# Altium schematic sheet Schematic.SchDoc
size A
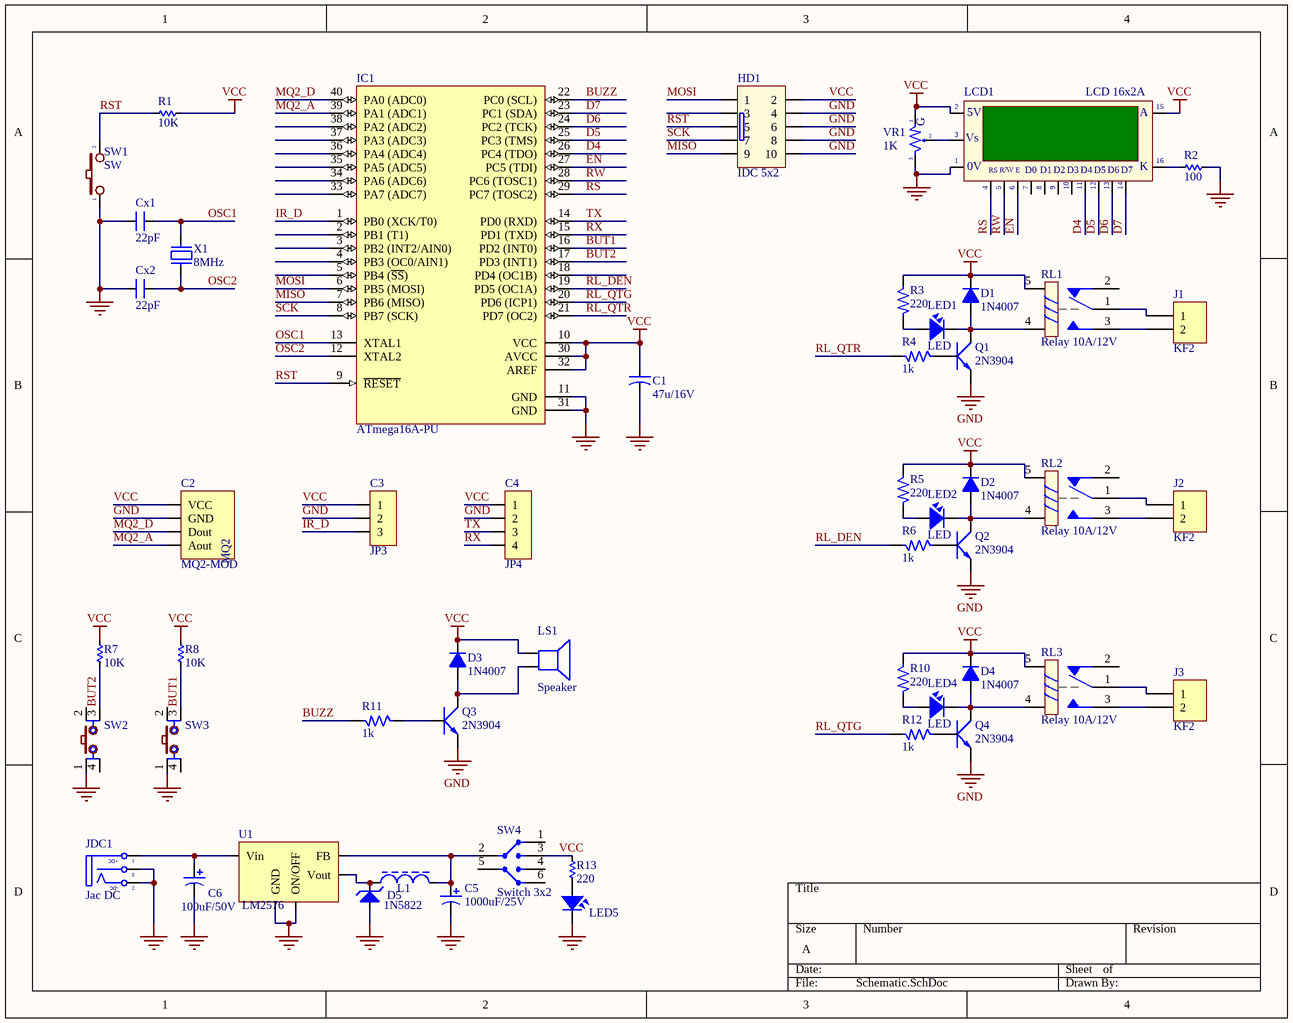
[diagram p0: Schematic.SchDoc]

## Parts
C1  47u/16V  [CA-ALU-2.54]
C2  MQ2-MOD  [MQ2-MODULE]
C3  JP3  [JP3-D1T]
C4  JP4  [JP4-C1T]
C5  value 1000uF/25V  [CE_12.5x20]  (hidden comment: CP4)
C6  value 100uF/50V  [CE_8x12]  (hidden comment: CP3)
Cx1  22pF  [CN1]
Cx2  22pF  [CN1]
D1  1N4007  [DIO-1A-SMALL]
D2  1N4007  [DIO-1A-SMALL]
D3  1N4007  [DIO-1A-SMALL]
D4  1N4007  [DIO-1A-SMALL]
D5  1N5822  [D5A]
HD1  IDC 5x2  [IDC10]
IC1  ATmega16A-PU  [DIP40/W0.6]
J1  KF2  [KF2-5.08]
J2  KF2  [KF2-5.08]
J3  KF2  [KF2-5.08]
JDC1  Jac DC  [DC0]
L1  INDUCTOR  [L]  (value not drawn)
LCD1  LCD 16x2A  [LCD16X2N]
LED1  LED  [LED-3MM-RED]
LED2  LED  [LED-3MM-RED]
LED4  LED  [LED-3MM-RED]
LED5  LED  [LED-3MM-RED]  (value not drawn)
LS1  Speaker  [SPEAKER]
Q1  2N3904  [TO92-123]
Q2  2N3904  [TO92-123]
Q3  2N3904  [TO92-123]
Q4  2N3904  [TO92-123]
R1  10K  [RES-1/4W-SMALL]
R2  100  [RES-1/4W-SMALL]
R3  220  [RES-1/4W-SMALL]
R4  1k  [RES-1/4W-SMALL]
R5  220  [RES-1/4W-SMALL]
R6  1k  [RES-1/4W-SMALL]
R7  10K  [RES-1/4W-SMALL]
R8  10K  [RES-1/4W-SMALL]
R10  220  [RES-1/4W-SMALL]
R11  1k  [RES-1/4W-SMALL]
R12  1k  [RES-1/4W-SMALL]
R13  220  [RES-1/4W-SMALL]
RL1  Relay 10A/12V  [RELAY 5]
RL2  Relay 10A/12V  [RELAY 5]
RL3  Relay 10A/12V  [RELAY 5]
SW1  SW  [SW2_6x6x6.5]
SW2  SW  [SW4-12x12x8]  (value not drawn)
SW3  SW  [SW4-12x12x8]  (value not drawn)
SW4  Switch 3x2  [SW3-DIP]
U1  LM2576  [TO-220_5]
VR1  1K  [VR-S2]
X1  8MHz  [XT2]

## Nets
GND: C1.2 C2.3(GND) C3.2 C4.2 C5.2 C6.2 Cx1.1 Cx2.1 D5.1 HD1.4 HD1.6 HD1.8 HD1.10 IC1.11(GND) IC1.31(GND) JDC1.2(TN) JDC1.3(S) LCD1.1(GND) LED5.2 Q1.1(E) Q2.1(E) Q3.1(E) Q4.1(E) R2.1 SW1.1 SW2.1 SW3.1 U1.3(GND) U1.5(ON/OFF) VR1.3
VCC: C1.1 C2.4(VCC) C3.1 C4.1 D1.2(K) D2.2(K) D3.2(K) D4.2(K) HD1.2 IC1.10(VCC) IC1.30(AVCC) IC1.32(AREF) LCD1.2(VDD) LCD1.15(A) LS1.1 R1.1 R3.1 R5.1 R7.2 R8.2 R10.1 R13.1 RL1.5 RL2.5 RL3.5 SW4.3(I/O2) VR1.1
BUT1: IC1.16(PD2_(INT0)) R8.1 SW3.3
BUT2: IC1.17(PD3_(INT1)) R7.1 SW2.3
BUZZ: IC1.22(PC0_(SCL)) R11.2
D4: IC1.26(PC4_(TDO)) LCD1.11(D4)
D5: IC1.25(PC3_(TMS)) LCD1.12(D5)
D6: IC1.24(PC2_(TCK)) LCD1.13(D6)
D7: IC1.23(PC1_(SDA)) LCD1.14(D7)
EN: IC1.27(PC5_(TDI)) LCD1.6(~{EN})
IR_D: C3.3 IC1.1(PB0_(XCK/T0))
MISO: HD1.9 IC1.7(PB6_(MISO))
MOSI: HD1.1 IC1.6(PB5_(MOSI))
MQ2_A: C2.1(Aout) IC1.39(PA1_(ADC1))
MQ2_D: C2.2(Dout) IC1.40(PA0_(ADC0))
OSC1: Cx1.2 IC1.13(XTAL1) X1.2
OSC2: Cx2.2 IC1.12(XTAL2) X1.1
RL_DEN: IC1.19(PD5_(OC1A)) R6.2
RL_QTG: IC1.20(PD6_(ICP1)) R12.2
RL_QTR: IC1.21(PD7_(OC2)) R4.2
RS: IC1.29(PC7_(TOSC2)) LCD1.4(RS)
RST: HD1.5 IC1.9(~{RESET}) R1.2 SW1.2
RW: IC1.28(PC6_(TOSC1)) LCD1.5(R/~{W})
RX: C4.4 IC1.15(PD1_(TXD))
SCK: HD1.7 IC1.8(PB7_(SCK))
TX: C4.3 IC1.14(PD0_(RXD))
NetC5_1: C5.1 L1.2 SW4.2 U1.4(FB)
NetC6_1: C6.1 JDC1.1(T) U1.1(Vin)
NetD1_1: D1.1(A) LED1.2 Q1.3(C) RL1.4
NetD2_1: D2.1(A) LED2.2 Q2.3(C) RL2.4
NetD3_1: D3.1(A) LS1.2 Q3.3(C)
NetD4_1: D4.1(A) LED4.2 Q4.3(C) RL3.4
NetD5_2: D5.2 L1.1 U1.2(Vout)
NetJ1_1: J1.1 RL1.1
NetJ1_2: J1.2 RL1.3
NetJ2_1: J2.1 RL2.1
NetJ2_2: J2.2 RL2.3
NetJ3_1: J3.1 RL3.1
NetJ3_2: J3.2 RL3.3
NetLCD1_3: LCD1.3(VEE) VR1.2
NetLCD1_16: LCD1.16(K) R2.2
NetLED1_1: LED1.1 R3.2
NetLED2_1: LED2.1 R5.2
NetLED4_1: LED4.1 R10.2
NetLED5_1: LED5.1 R13.2
NetQ1_2: Q1.2(B) R4.1
NetQ2_2: Q2.2(B) R6.1
NetQ3_2: Q3.2(B) R11.1
NetQ4_2: Q4.2(B) R12.1

Not connected (* = marked no-connect by the designer): HD1 3; IC1 2(PB1_(T1)) 3(PB2_(INT2/AIN0)) 4(PB3_(OC0/AIN1)) 5(PB4_(~{SS})) 18(PD4_(OC1B)) 33(PA7_(ADC7)) 34(PA6_(ADC6)) 35(PA5_(ADC5)) 36(PA4_(ADC4)) 37(PA3_(ADC3)) 38(PA2_(ADC2)); LCD1 7(D0) 8(D1) 9(D2) 10(D3); RL1 2; RL2 2; RL3 2; SW2 2 4; SW3 2 4; SW4 1 4 5(6) 6

## Notes on the sheet
- (in symbol DCIN) +DC; -DC
- (in symbol LCD16x2A) 5V; Vs; |; 0V; R/W; E
- (in symbol MQ2-MOD) MQ2
- (in symbol VR-S) G

## Library data of the parts
C1 = CN-ALU-DIP: Capacitor (Semiconductor SIM Model); Value: 104; LatestRevisionDate: 17-Jul-2002; LatestRevisionNote: Re-released for DXP Platform.; PackageReference: C1206; Publisher: Altium Limited
C2 = MQ2-MOD: Manufacturer: W¨¹rth Elektronik eiSos GmbH; partNo: 613004143121; ComponentLink1 Description: Manufacturer; ComponentLink2 Description: Datasheet; NoPins: 04; Created Date: 29 March 2013; ComponentLink1URL: http://www.we-online.com; ComponentLink2URL: http://katalog.we-online.de/em/datasheet/6130xx143121.pdf; Created by: Karrer Zheng
C3 = JP3: WR-PHD 2.54 mm Angled Socket Header; Manufacturer: W¨¹rth Elektronik eiSos GmbH; partNo: 613003143121; ComponentLink1 Description: Manufacturer; ComponentLink2 Description: Datasheet; NoPins: 03; Created Date: 29 March 2013; ComponentLink1URL: http://www.we-online.com; ComponentLink2URL: http://katalog.we-online.de/em/datasheet/6130xx143121.pdf; Created by: Karrer Zheng
C4 = JP4: WR-PHD 2.54 mm Angled Socket Header; Manufacturer: W¨¹rth Elektronik eiSos GmbH; partNo: 613004143121; ComponentLink1 Description: Manufacturer; ComponentLink2 Description: Datasheet; NoPins: 04; Created Date: 29 March 2013; ComponentLink1URL: http://www.we-online.com; ComponentLink2URL: http://katalog.we-online.de/em/datasheet/6130xx143121.pdf; Created by: Karrer Zheng
C5 = CP4: Cap P  1000uF/16V - 220uF/50V; Description 1: 2200uF-3300uF/6,3V - 1000uF-2200uF/10V; Description 2: 1000uF/16V - 470uF => 1000uF/25V - 100uF/100V; Description 3: 330uF>470uF/35V_220uF>470uF/50V_10uF>22uF/250V; Description 4: 220uF => 330uF/63V - 10uF =>33uF/160 - 200V; Description 5: 4,7uF>10uF/250V_3,3uF>10uF/400V - 2,2uF>4,7uF/450V
C6 = CP3: Cap P  470uF/16V - 100uF?35V; Description 1: 1000uF/6,3V - 470uF/16V - 330uF - 25V; Description 2: 220uF/35V - 100uF/50V - 63V - 4,7uF/200V; Description 3: 22uF => 33uF100V - 3,3uF => 4,7uF/250V; Description 4: 2,2uF =>3,3uF/350 - 2,2uF/400V - 1uF/450V
Cx1 Cx2 = CN: Value: 33pF
D1-D4 = D1A: Diode 1A; Value: 1N4007
HD1 = IDC 5X2: Value: Header 5x2
IC1 = ATmega16A-PU: 8-Bit AVR Microcontroller with 16K Bytes of In-System Programmable Flash Memory; Value: Atmega 16L
J1-J3 = KF2: Manufacturer: Würth Elektronik eiSos GmbH; partNo: 691103110002; ComponentLink1 Description: Manufacturer; ComponentLink2 Description: Datasheet; NoPins: 2; Created Date: 29 October 2013; ComponentLink1URL: http://www.we-online.com; ComponentLink2URL: http://katalog.we-online.de/em/datasheet/6911031100xx.pdf; Created by: Karrer Zheng
JDC1 = DCIN: Jac DC input; Value: Jac DC
LCD1 = LCD16x2A: LCD dipslay 16 char, 2 line; Value: LCD16x2A
LED1 LED2 LED4 = LED: LED Single colour Green and Red; Value: LED 3 ly Single Colour
LED5 = LED SMD: Value: LED 3 - 5 ly 2 Colour
LS1 = Speaker: Loudspeaker; Published: 24-Mar-1999; LatestRevisionDate: 17-Jul-2002; LatestRevisionNote: Re-released for DXP Platform.; PackageReference: PIN2; Publisher: Altium Limited
Q1-Q4 = 2N904: NPN 600mW, ECB; Value: C1815
R1 R2 R7 R8 R13 = Res-SMD: Resistor; Manufacturer: Generic Components; Class: Passive; Published: 08/06/2000; Publisher: Altium Hobart Technology Centre
R3-R6 R10-R12 = R: Resistor 1/4W; Value: R1/4W - 1K
RL1-RL3 = Relay 5: Relay SPDT,10A - 12VDC 5 Pin; Value: Relay SPDT, 10A, 12V
SW1 = SW2: Switch button 2 pin; Value: SW chip 2 pin
SW2 SW3 = SW4: Switch button 4 pin; Value: Button chip 4 pin
SW4 = SW3x2: Value: Switch 4x2
U1 = LM2576: 3A Step-down Voltage Regulator
VR1 = VR-S: Var Resistor; Value: Volume 50k
X1 = XT2: Crystal, 32.768 KHz, -40 to 85 degC, 3.2 x 1.5 x 0.9 mm SMD; Value: 4Mhz